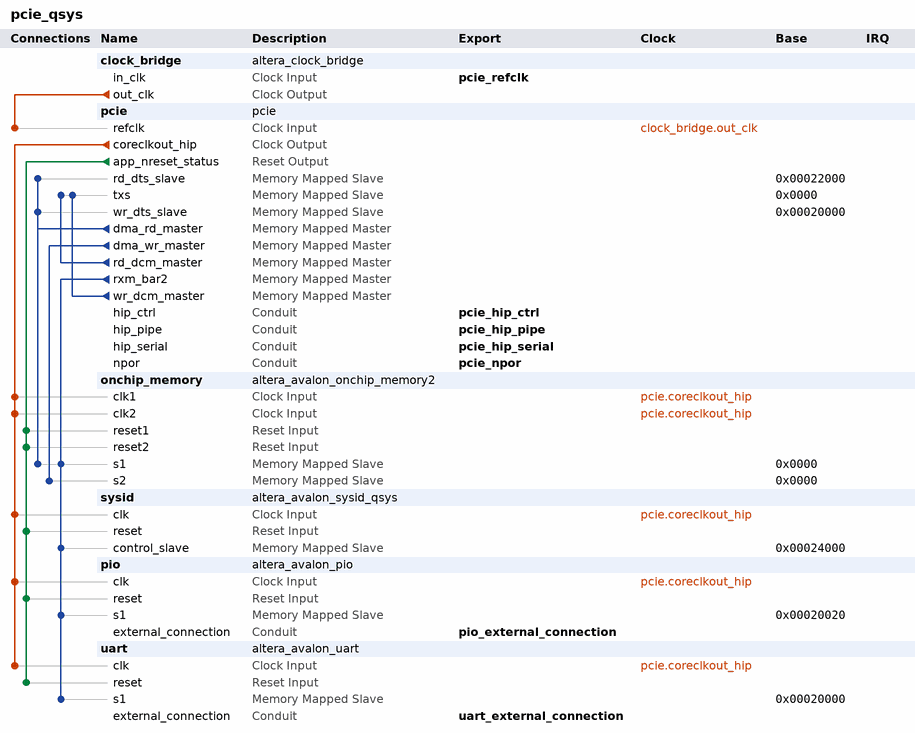
[diagram p0: system contents]
# Platform Designer (Qsys) system pcie_qsys, Arria 10 10AX027H4F34I3SG
# Parameters at their usual value, and those the tool derives, are not listed.
package require -exact qsys 1.0
create_system pcie_qsys
set_project_property DEVICE_FAMILY {Arria 10}
set_project_property DEVICE 10AX027H4F34I3SG

add_component clock_bridge ip/pcie_qsys_clock_bridge.ip altera_clock_bridge clock_bridge 19.1

add_component pcie {} pcie pcie 19.1

add_component onchip_memory ip/pcie_qsys_onchip_memory.ip altera_avalon_onchip_memory2 onchip_memory 19.1

add_component sysid ip/pcie_qsys_sysid.ip altera_avalon_sysid_qsys sysid 19.1

add_component pio ip/pcie_qsys_pio.ip altera_avalon_pio pio 19.1

add_component uart ip/pcie_qsys_uart.ip altera_avalon_uart uart 19.1

# connections
add_connection clock_bridge.out_clk pcie.refclk clock
add_connection pcie.coreclkout_hip onchip_memory.clk1 clock
add_connection pcie.coreclkout_hip onchip_memory.clk2 clock
add_connection pcie.coreclkout_hip pio.clk clock
add_connection pcie.coreclkout_hip sysid.clk clock
add_connection pcie.coreclkout_hip uart.clk clock
add_connection pcie.app_nreset_status onchip_memory.reset1 reset
add_connection pcie.app_nreset_status onchip_memory.reset2 reset
add_connection pcie.app_nreset_status pio.reset reset
add_connection pcie.app_nreset_status sysid.reset reset
add_connection pcie.app_nreset_status uart.reset reset
add_connection pcie.dma_rd_master onchip_memory.s1 avalon
set_connection_parameter_value pcie.dma_rd_master/onchip_memory.s1 baseAddress 0x0000
add_connection pcie.dma_rd_master pcie.rd_dts_slave avalon
set_connection_parameter_value pcie.dma_rd_master/pcie.rd_dts_slave baseAddress 0x00022000
add_connection pcie.dma_rd_master pcie.wr_dts_slave avalon
set_connection_parameter_value pcie.dma_rd_master/pcie.wr_dts_slave baseAddress 0x00020000
add_connection pcie.dma_wr_master onchip_memory.s2 avalon
set_connection_parameter_value pcie.dma_wr_master/onchip_memory.s2 baseAddress 0x0000
add_connection pcie.rd_dcm_master pcie.txs avalon
set_connection_parameter_value pcie.rd_dcm_master/pcie.txs baseAddress 0x0000
add_connection pcie.rxm_bar2 onchip_memory.s1 avalon
set_connection_parameter_value pcie.rxm_bar2/onchip_memory.s1 baseAddress 0x0000
add_connection pcie.rxm_bar2 pio.s1 avalon
set_connection_parameter_value pcie.rxm_bar2/pio.s1 baseAddress 0x00020020
add_connection pcie.rxm_bar2 sysid.control_slave avalon
set_connection_parameter_value pcie.rxm_bar2/sysid.control_slave baseAddress 0x00024000
add_connection pcie.rxm_bar2 uart.s1 avalon
set_connection_parameter_value pcie.rxm_bar2/uart.s1 baseAddress 0x00020000
add_connection pcie.wr_dcm_master pcie.txs avalon
set_connection_parameter_value pcie.wr_dcm_master/pcie.txs baseAddress 0x0000

# exported interfaces
add_interface pcie_hip_ctrl conduit end
set_interface_property pcie_hip_ctrl EXPORT_OF pcie.hip_ctrl
add_interface pcie_hip_pipe conduit end
set_interface_property pcie_hip_pipe EXPORT_OF pcie.hip_pipe
add_interface pcie_hip_serial conduit end
set_interface_property pcie_hip_serial EXPORT_OF pcie.hip_serial
add_interface pcie_npor conduit end
set_interface_property pcie_npor EXPORT_OF pcie.npor
add_interface pcie_refclk clock sink
set_interface_property pcie_refclk EXPORT_OF clock_bridge.in_clk
add_interface pio_external_connection conduit end
set_interface_property pio_external_connection EXPORT_OF pio.external_connection
add_interface uart_external_connection conduit end
set_interface_property uart_external_connection EXPORT_OF uart.external_connection

save_system pcie_qsys.qsys
